# Altium project Kursovaya.PrjPcb
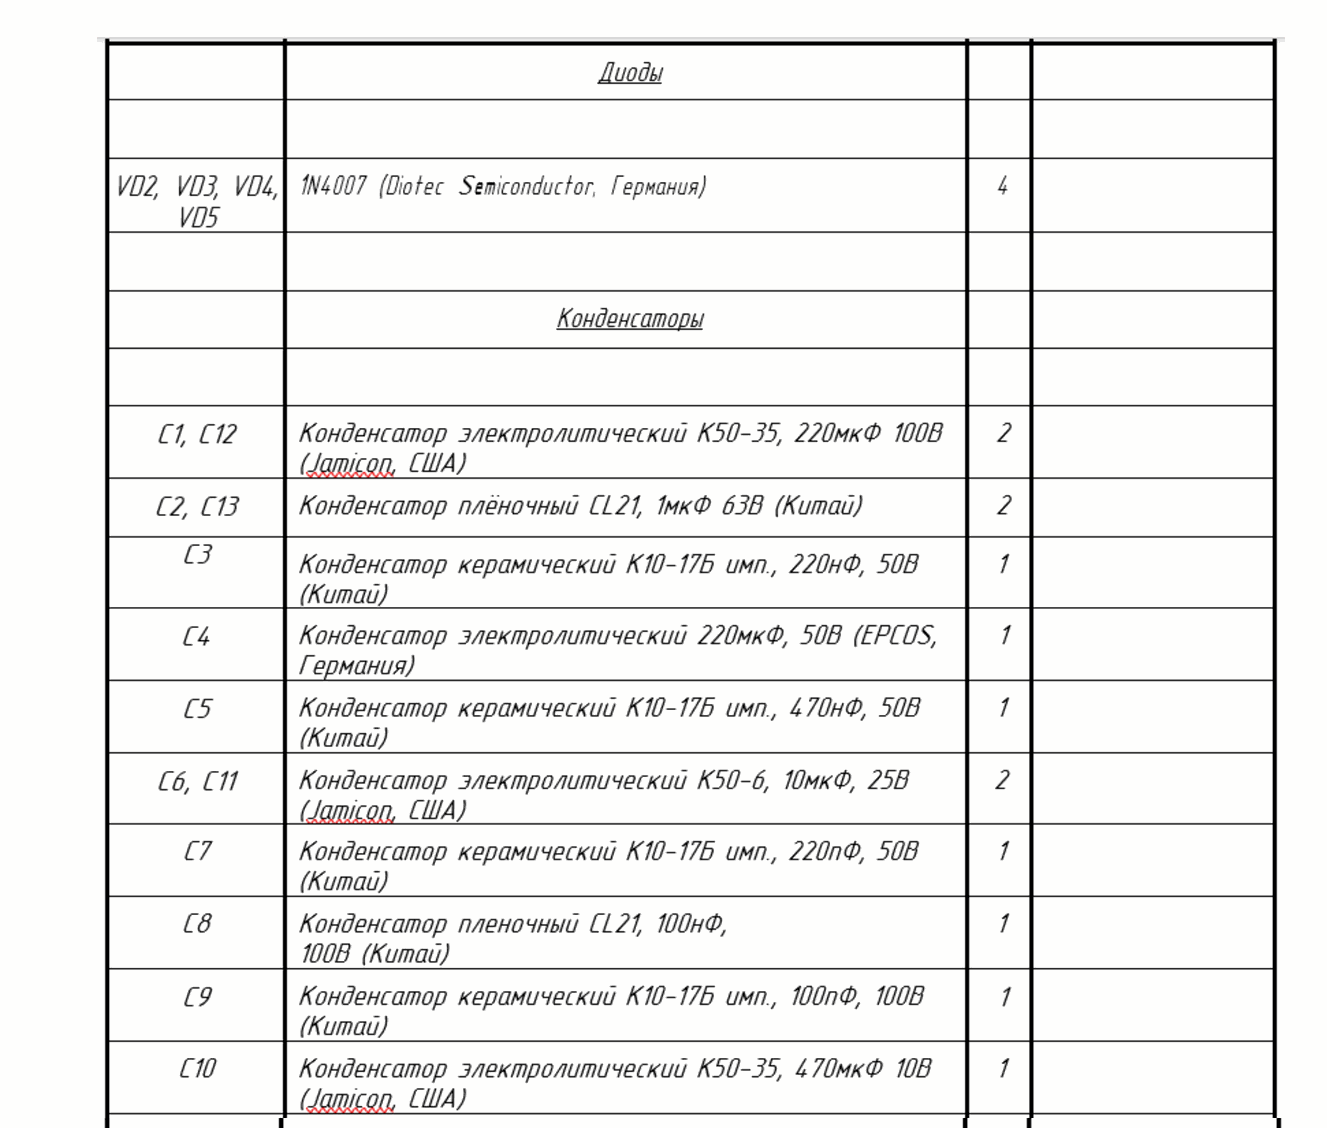
[diagram p0: Э3А1.SchDoc, top right]
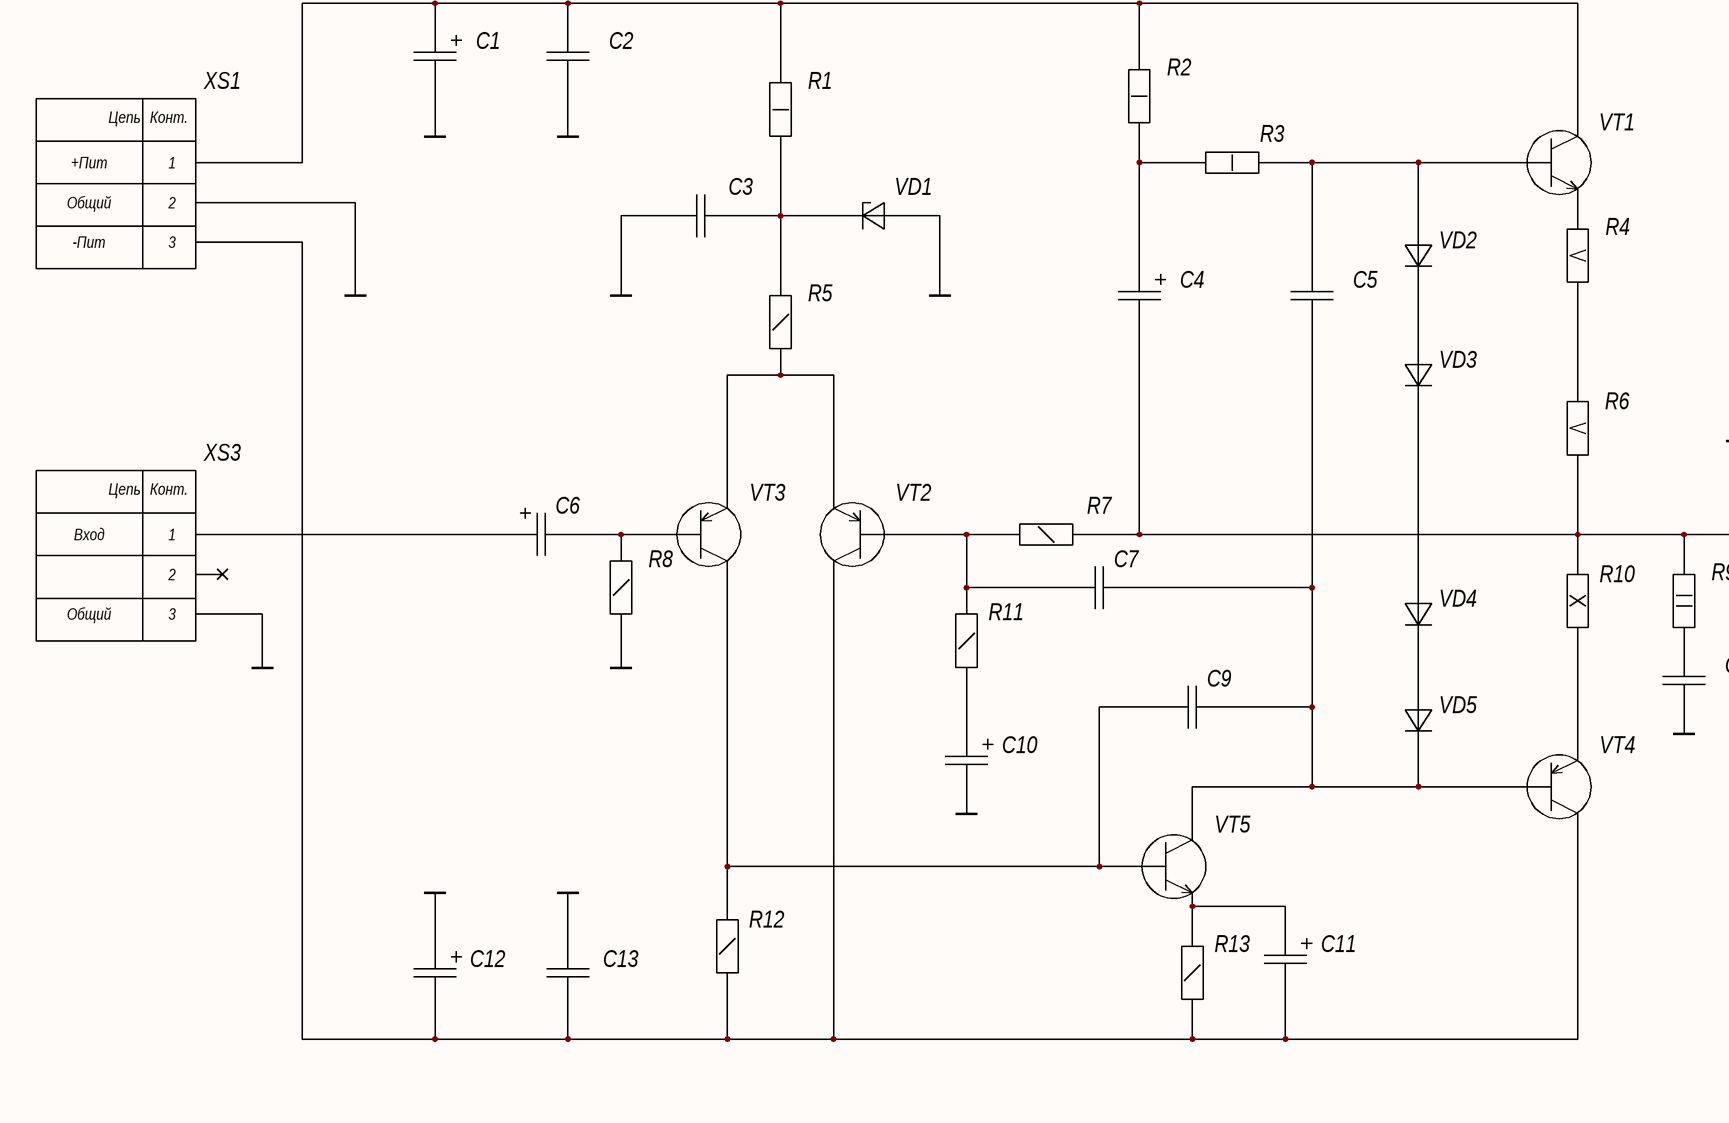
[diagram p1: Э3А1.SchDoc, bottom left]
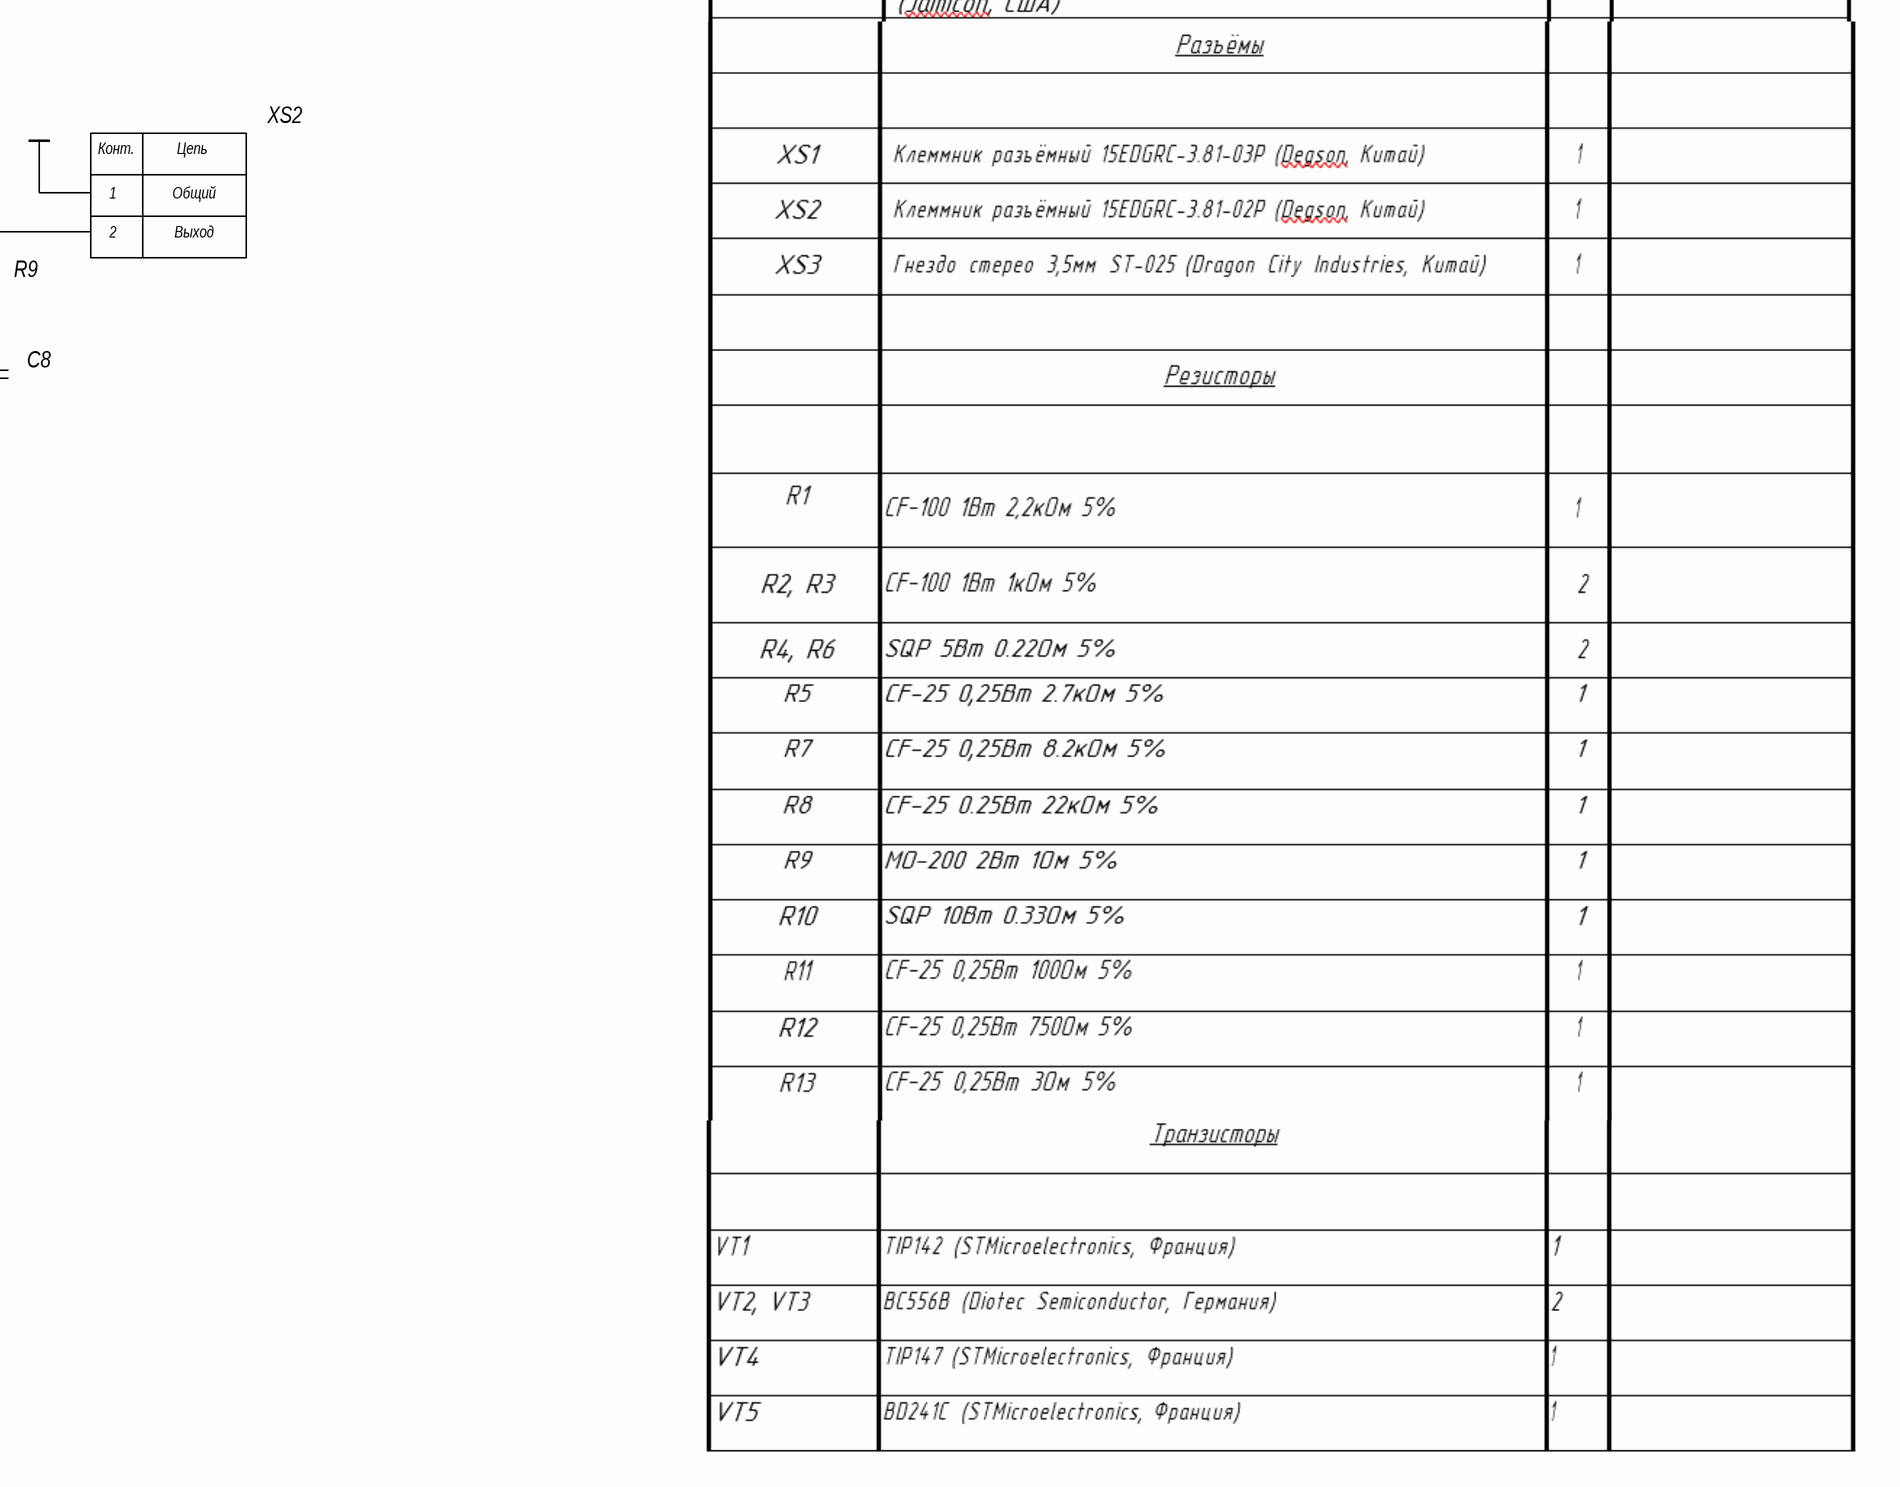
[diagram p2: Э3А1.SchDoc, bottom right]
4 sheets, 86 parts. Net scope: global (net labels, ports and power ports of the same name join across sheets).
Board files: PCBv1.PcbDoc, PCBv2.PcbDoc
Sheets:
  Э3А1.SchDoc
  Э1.SchDoc
  ПД1.SchDoc
  Э3А3.SchDoc

## Sheet Э3А1.SchDoc: Усилитель
size 840 x 594 mm; CheckedBy: Семенцов С.Г.; Author: Дорунц Ш.А.; Address1: Address1; Address2: Address2; Address3: Address3; Address4: Address4; DocumentNumber: ИУ4.11.03.03.23.05.52.09.001 Э3; SheetNumber: 1; SheetTotal: 3; Scale: 1:1; Title2str: Низких Частот; DocumentType: Схема электрическая принципиальная; FirstReferrence: ИУ4.11.03.03.23.05.52.09.001; UniversityName: МГТУ им. Н.Э. Баумана; DepartmentName: Кафедра ИУ4; GroupName: Группа ИУ4-52Б

### Parts
(Parts that share a designator on the sheet are numbered #1, #2 ... from top to bottom, then left to right.)
C1  220uF/100V  [Cap 220U/100V]  (value not drawn)
C2  1uF/63V  [Cap 1u/63V]  (value not drawn)
C3#1  220nF  [Cap 220nF]  (value not drawn)
C4#1  220uF/50V  [Cap 220U/100V]  (value not drawn)
C5  470nF  [Cap 470n]  (value not drawn)
C6#1  10uF/25V  [Cap 10u/25V]  (value not drawn)
C7#1  220pF  [Cap 220p]  (value not drawn)
C8  100nF/100V  [Cap 100n/100V]  (value not drawn)
C9  100pF/100V  [Cap 100p]  (value not drawn)
C10#1  470uF/10V  [Cap 470u/10V]  (value not drawn)
C11  10uF/25V  [Cap 10u/25V]  (value not drawn)
C12  220uF/100V  [Cap 220U/100V]  (value not drawn)
C13  1uF/63V  [Cap 1u/63V]  (value not drawn)
R1#1  Resistor 1W  [Res 1W]  (value not drawn)
R2#1  Resistor 1W  [Res 1W]  (value not drawn)
R3#1  Resistor 1W  [Res 1W]  (value not drawn)
R4#1  Resistor 5W  [Res 5W]  (value not drawn)
R5#1  Resistor 0.25W  [Res 0.25W]  (value not drawn)
R6#1  Resistor 5W  [Res 5W]  (value not drawn)
R7#1  Resistor 0.25W  [Res 0.25W]  (value not drawn)
R8#1  Resistor 0.25W  [Res 0.25W]  (value not drawn)
R9#1  Resistor 2W  [Res 2W]  (value not drawn)
R10#1  Resistor 10W  [Res 10W]  (value not drawn)
R11#1  Resistor 0.25W  [Res 0.25W]  (value not drawn)
R12#1  Resistor 0.25W  [Res 0.25W]  (value not drawn)
R13#1  Resistor 0.25W  [Res 0.25W]  (value not drawn)
VD1#1  ZPD12  [DO-35]  (value not drawn)
VD2  Diode 1N4001  [DO-41]  (value not drawn)
VD3  Diode 1N4001  [DO-41]  (value not drawn)
VD4  Diode 1N4001  [DO-41]  (value not drawn)
VD5  Diode 1N4001  [DO-41]  (value not drawn)
VT1  TIP142  [TO-247]  (value not drawn)
VT2#1  BC556B  [TO-92-A]  (value not drawn)
VT3#1  BC556B  [TO-92-A]  (value not drawn)
VT4  TIP147  [TO-247]  (value not drawn)
VT5  BD241C  [TO-220]  (value not drawn)
XS1#1  Connector 15EDGRC-3.81-03P  [15EDGRC-3.81-03P]  (value not drawn)
XS2#1  Connector 15EDGRC-3.81-02P  [15EDGRC-3.81-02P]  (value not drawn)
XS3#1  Connector ST-025  [ST-025]  (value not drawn)

### Nets
GND: C1.2 C2.1 C3#1.2 C8.1 C10#1.2 C12.1 C13.1 R8#1.1 VD1#1.1(А) XS1#1.2 XS2#1.1 XS3#1.3
NetC1_1: C1.1 C2.2 R1#1.2 R2#1.2 VT1.2(C) XS1#1.1
NetC3#1_1: C3#1.1 R1#1.1 R5#1.2 VD1#1.2(К)
NetC4#1_1: C4#1.1 R2#1.1 R3#1.1
NetC4#1_2: C4#1.2 R6#1.2 R7#1.2 R9#1.2 R10#1.2 XS2#1.2
NetC5_1: C5.1 C7#1.2 C9.2 VD5.2(К) VT4.1(B) VT5.2(C)
NetC5_2: C5.2 R3#1.2 VD2.1(А) VT1.1(B)
NetC6#1_1: C6#1.1 XS3#1.1
NetC6#1_2: C6#1.2 R8#1.2 VT3#1.2(B)
NetC7#1_1: C7#1.1 R7#1.1 R11#1.2 VT2#1.2(B)
NetC8_2: C8.2 R9#1.1
NetC9_1: C9.1 R12#1.2 VT3#1.1(C) VT5.1(B)
NetC10#1_1: C10#1.1 R11#1.1
NetC11_1: C11.1 R13#1.2 VT5.3(E)
NetC11_2: C11.2 C12.2 C13.2 R12#1.1 R13#1.1 VT2#1.1(C) VT4.2(C) XS1#1.3
NetR4#1_1: R4#1.1 VT1.3(E)
NetR4#1_2: R4#1.2 R6#1.1
NetR5#1_1: R5#1.1 VT2#1.3(E) VT3#1.3(E)
NetR10#1_1: R10#1.1 VT4.3(E)
NetVD2_2: VD2.2(К) VD3.1(А)
NetVD3_2: VD3.2(К) VD4.1(А)
NetVD4_2: VD4.2(К) VD5.1(А)

Not connected (* = marked no-connect by the designer): XS3#1 2*

### Notes on the sheet
- +Пит
- Общий
- -Пит
- Вход
- Выход
- Перв. примен.
- Справ. №
- Подп. и дата
- Инв. № дубл.
- Взам. инв. №
- Разраб.
- Изм.
- Лист
- № докум.
- Подп.
- Дата
- Лит.
- Масса
- Масштаб
- Пров.
- Т.контр.
- Листов
- 1
- Инв. № подл.
- Утв.
- Н.контр.
- 2.106-A1
- Копировал
- Формат А1
- (in symbol Connector 15EDGRC-3.81-02P) Конт.; Цепь
- (in symbol Connector 15EDGRC-3.81-03P) Цепь; Конт.
- (in symbol Connector ST-025) Цепь; Конт.

### Library data of the parts
C1 C12 = Capacitor 220uF 100V: Type: Конденсатор; Published: 18.05.2010; Publisher: Andrew Danich
C2 C13 = Capacitor 1uF 63V: Type: Конденсатор; Published: 18.05.2010; Publisher: Andrew Danich
C3#1 = Capacitor 220nF: Type: Конденсатор; Published: 18.05.2010; Publisher: Andrew Danich
C4#1 = Capacitor 220uF 50V: Type: Конденсатор; Published: 18.05.2010; Publisher: Andrew Danich
C5 = Capacitor 470nF: Type: Конденсатор; Published: 18.05.2010; Publisher: Andrew Danich
C6#1 C11 = Capacitor 10uF 25V: Type: Конденсатор; Published: 18.05.2010; Publisher: Andrew Danich
C7#1 = Capacitor 220pF: Type: Конденсатор; Published: 18.05.2010; Publisher: Andrew Danich
C8 = Capacitor 100nF 100V: Type: Конденсатор; Published: 18.05.2010; Publisher: Andrew Danich
C9 = Capacitor 100pF 100V: Type: Конденсатор; Published: 18.05.2010; Publisher: Andrew Danich
C10#1 = Capacitor 470uF 10V: Type: Конденсатор; Published: 18.05.2010; Publisher: Andrew Danich
VD1#1 = ZPD12: Type: Стабилитрон; Published: 20.05.2013; Publisher: Andrew Danich
VD2-VD5 = Diode 1N4001: Type: Диод; Published: 18.05.2010; Publisher: Andrew Danich
R1#1 R2#1 R3#1 = Resistor 1W: Published: 24.03.2010; Publisher: Andrew Danich; Type: Резистор
R4#1 R6#1 = Resistor 5W: Published: 24.03.2010; Publisher: Andrew Danich; Type: Резистор
R5#1 R7#1 R8#1 R11#1 R12#1 R13#1 = Resistor 0.25W: Published: 24.03.2010; Publisher: Andrew Danich; Type: Резистор
R9#1 = Resistor 2W: Published: 24.03.2010; Publisher: Andrew Danich; Type: Резистор
R10#1 = Resistor 10W: Published: 24.03.2010; Publisher: Andrew Danich; Type: Резистор

## Sheet Э1.SchDoc: Усилитель
size 420 x 297 mm; =Author: Дорунц Ш.А.; CheckedBy: Семенцов С.Г.; Author: Дорунц Ш.А.; Address1: Address1; Address2: Address2; Address3: Address3; Address4: Address4; DocumentNumber: ИУ4.11.03.03.23.05.09.001 Э1; SheetNumber: 2; SheetTotal: 4; Scale: 1:1; Title2str: низких частот; DocumentType: Схема электрическая структурная; FirstReferrence: ИУ4.11.03.03.23.05.52.09.001; UniversityName: МГТУ им. Н.Э. Баумана; DepartmentName: Кафедра ИУ4; GroupName: Группа ИУ4-52Б
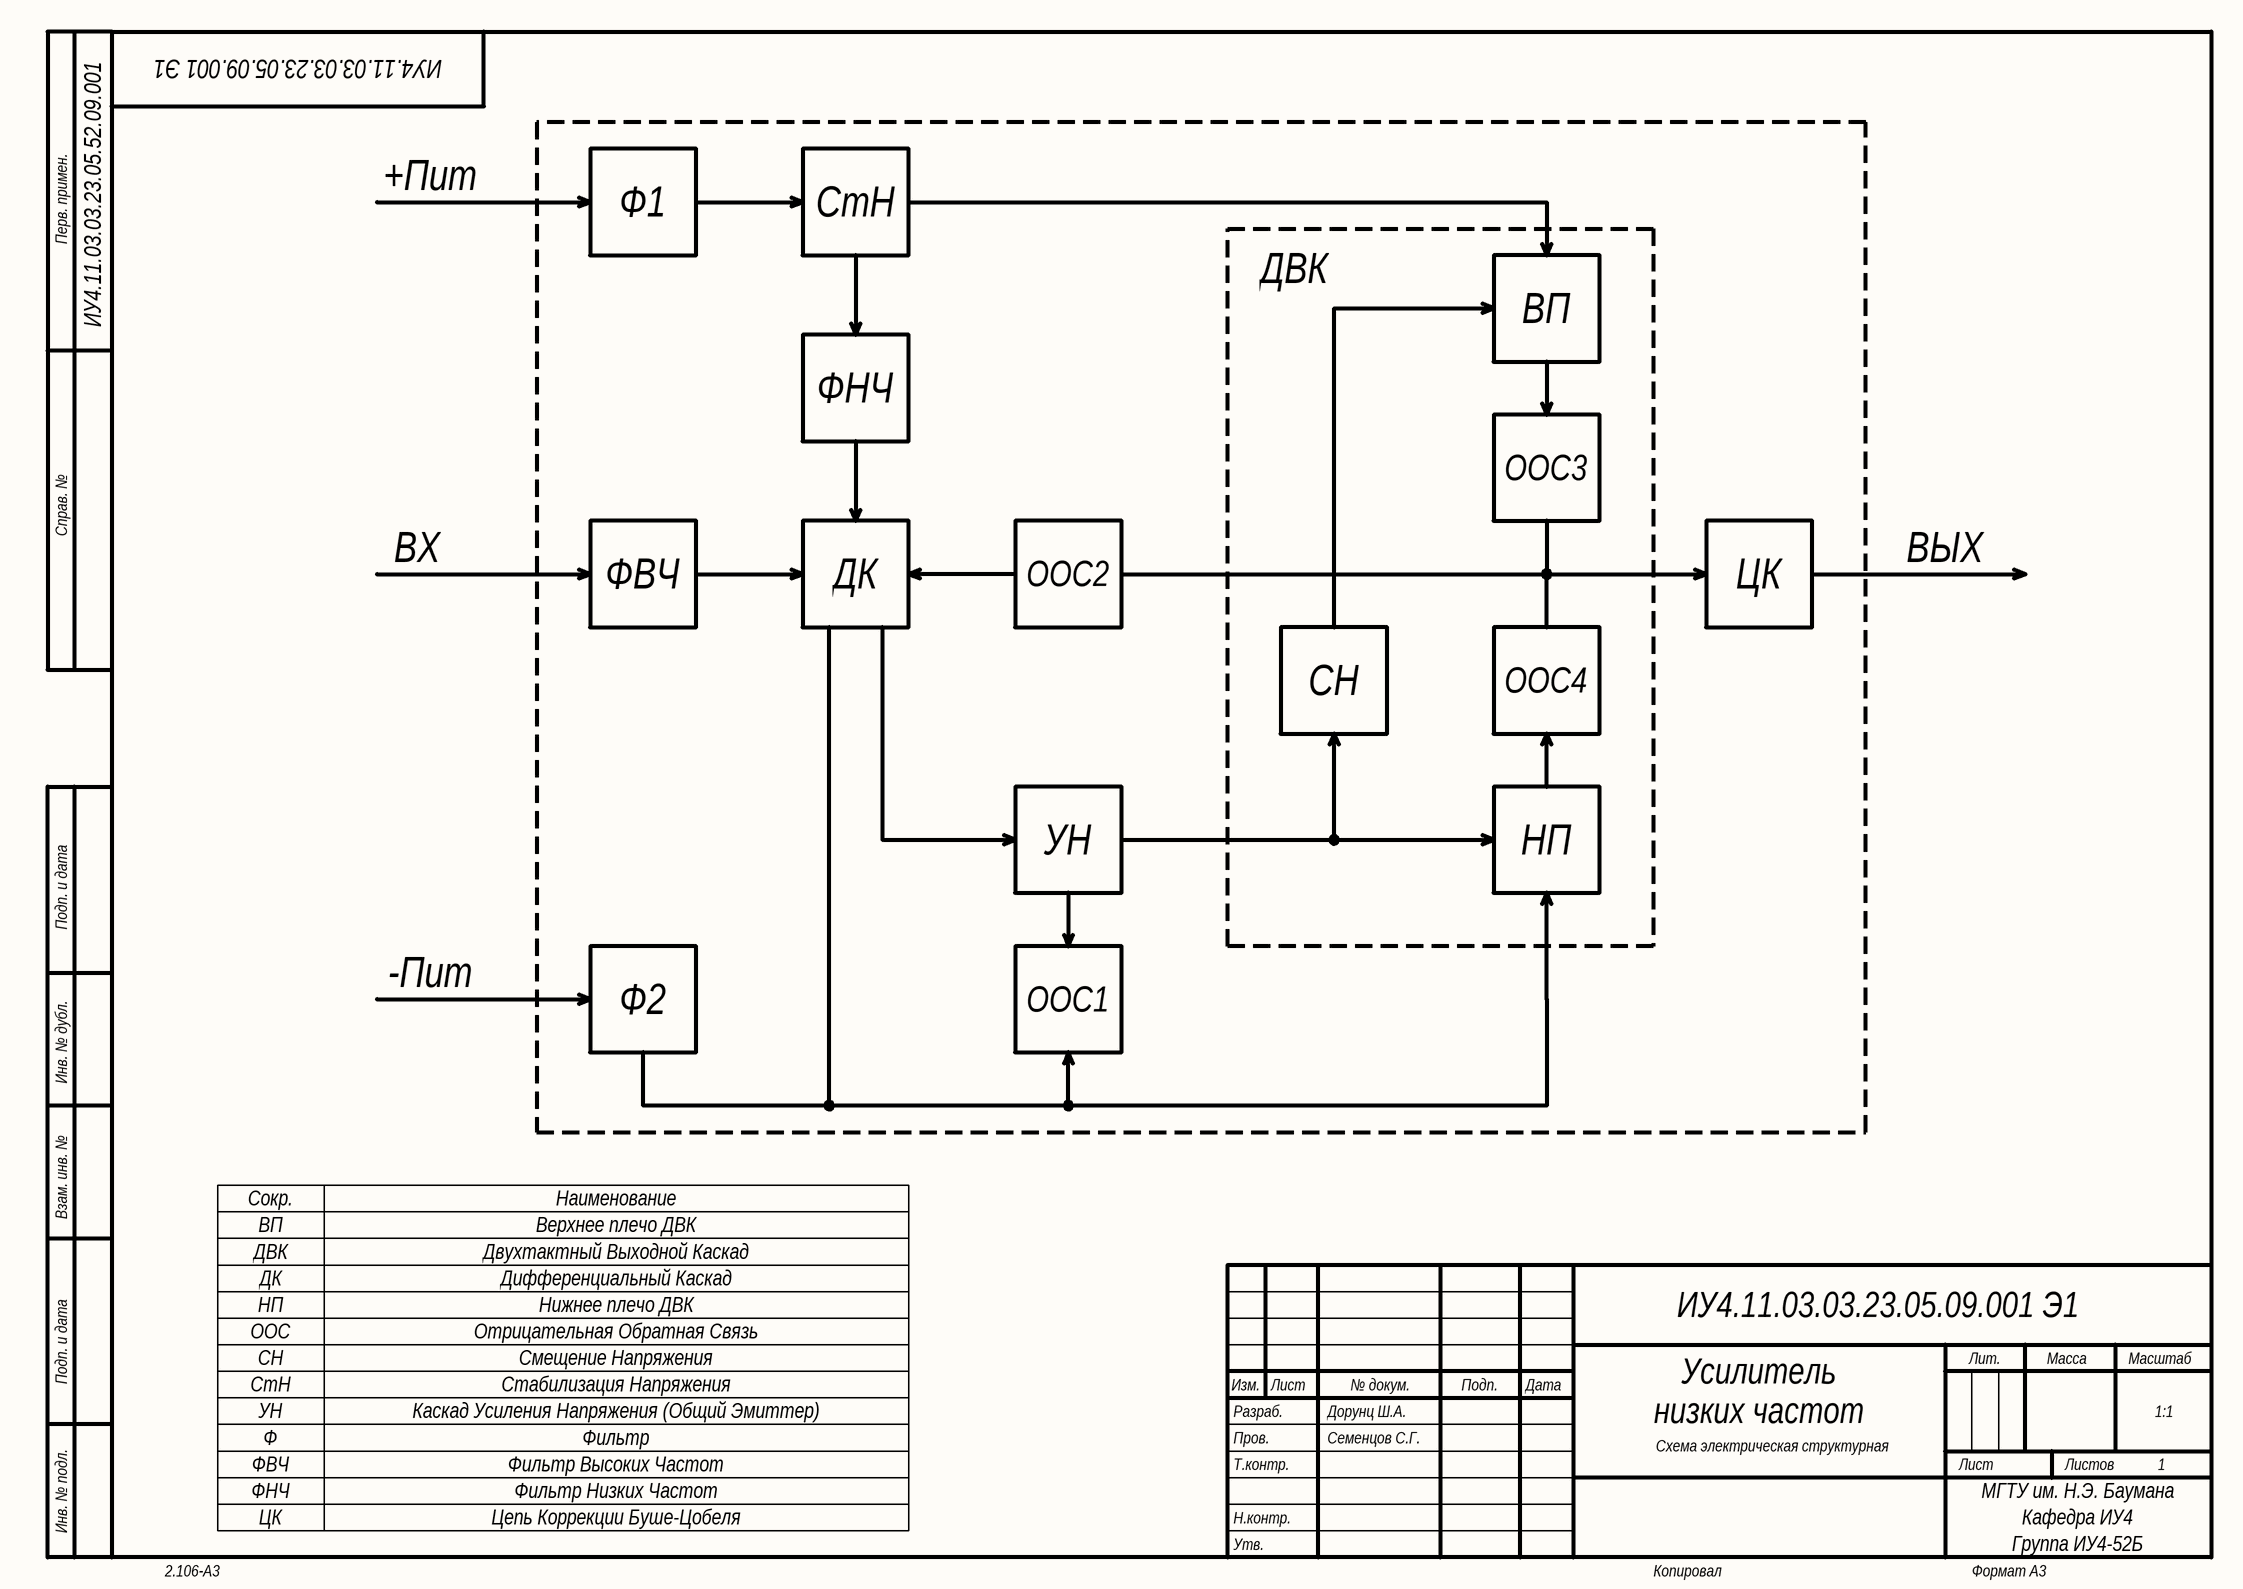
[diagram p3: Э1.SchDoc]

### Notes on the sheet
- +Пит
- Ф1
- СтН
- ДВК
- ВП
- ФНЧ
- ООС3
- ВХ
- ФВЧ
- ДК
- ООС2
- ЦК
- ВЫХ
- СН
- ООС4
- УН
- НП
- -Пит
- Ф2
- ООС1
- Сокр.
- Наименование
- Верхнее плечо ДВК
- Двухтактный Выходной Каскад
- Дифференциальный Каскад
- ООС
- Нижнее плечо ДВК
- Отрицательная Обратная Связь
- Каскад Усиления Напряжения (Общий Эмиттер)
- Смещение Напряжения
- Стабилизация Напряжения
- Ф
- Фильтр
- Фильтр Высоких Частот
- Цепь Коррекции Буше-Цобеля
- Фильтр Низких Частот
- Перв. примен.
- Справ. №
- Подп. и дата
- Инв. № дубл.
- Взам. инв. №
- Разраб.
- Изм.
- Лист
- № докум.
- Подп.
- Дата
- Лит.
- Масса
- Масштаб
- Пров.
- Т.контр.
- Листов
- 1
- Инв. № подл.
- Утв.
- Н.контр.
- 2.106-A3
- Копировал
- Формат А3

## Sheet ПД1.SchDoc: Усилитель
size 420 x 297 mm; CheckedBy: Семенцов С.Г.; Author: Дорунц Ш.А.; Address1: Address1; Address2: Address2; Address3: Address3; Address4: Address4; DocumentNumber: ИУ4.11.03.03.23.05.09.001; SheetNumber: 3; SheetTotal: 4; Scale: 1:1; Title2str: Низких Частот; DocumentType: Схема измерительного стенда; FirstReferrence: ИУ4.11.03.03.23.05.52.09.001; UniversityName: МГТУ им. Н.Э. Баумана; DepartmentName: Кафедра ИУ4; GroupName: Группа ИУ4-52Б
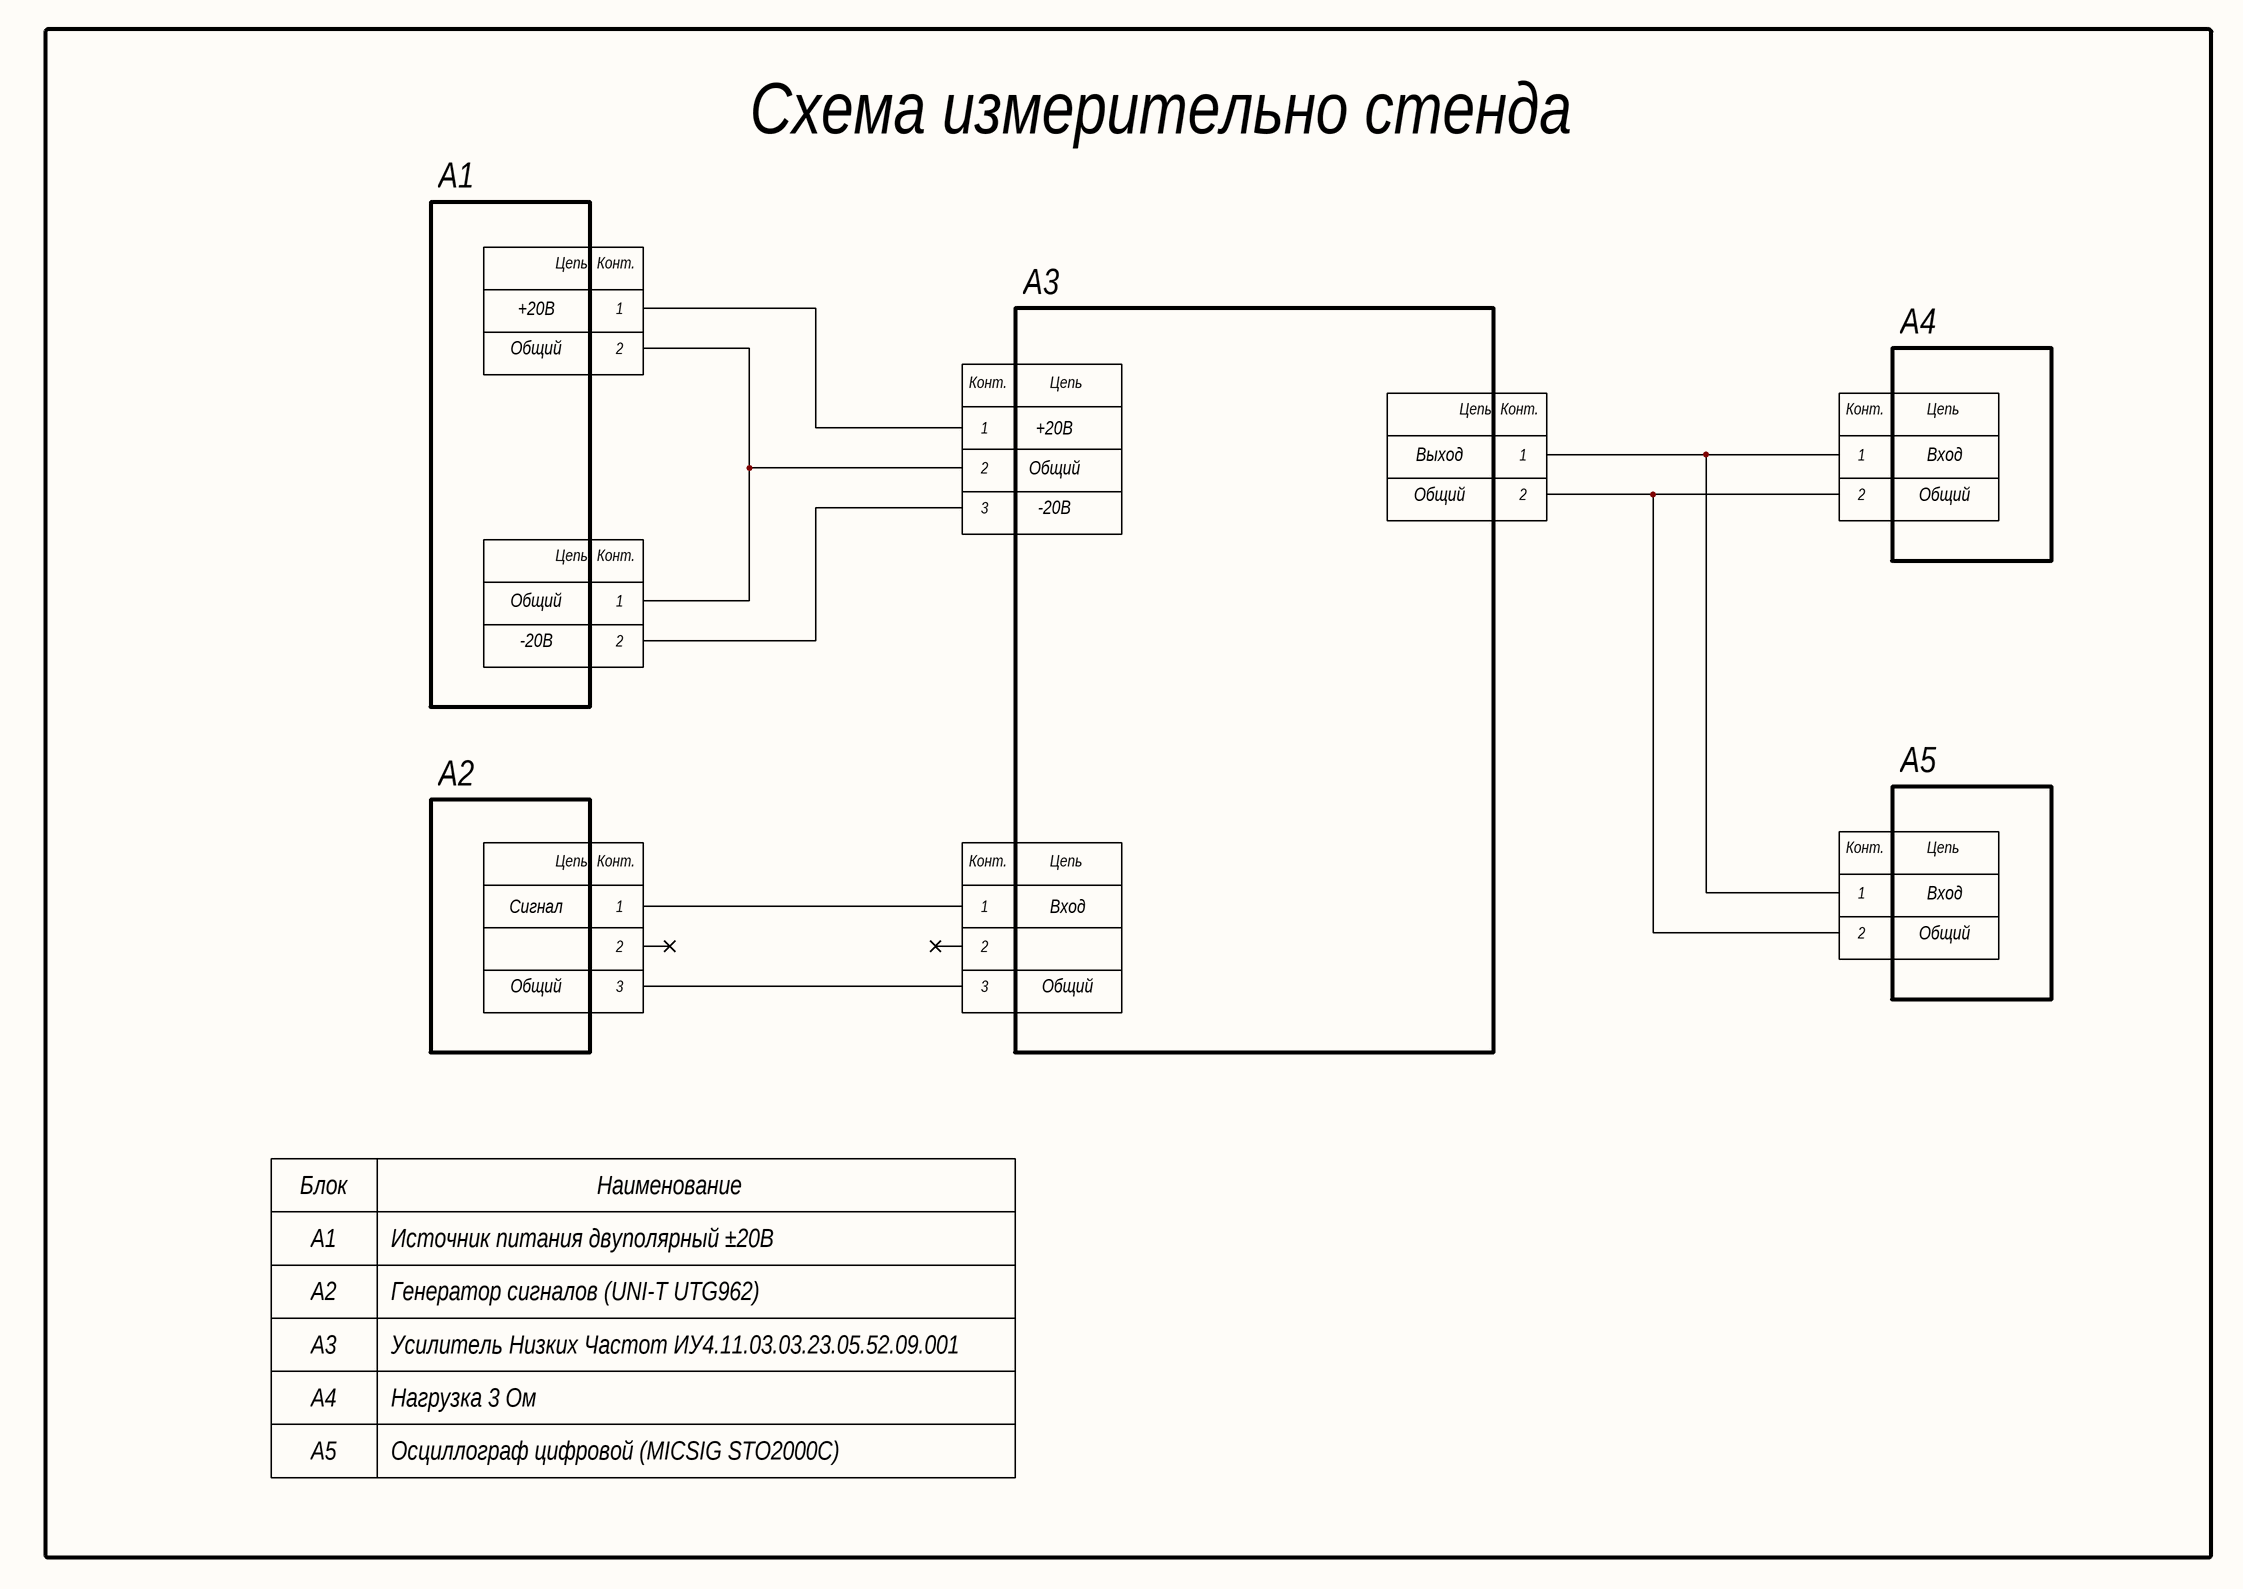
[diagram p4: ПД1.SchDoc]

### Parts
XS4  Connector 15EDGRC-3.81-02P  [15EDGRC-3.81-02P]  (value not drawn)
XS5  Connector 15EDGRC-3.81-03P  [15EDGRC-3.81-03P]  (value not drawn)
XS6  Connector 15EDGRC-3.81-02P  [15EDGRC-3.81-02P]  (value not drawn)
XS7  Connector 15EDGRC-3.81-02P  [15EDGRC-3.81-02P]  (value not drawn)
XS8  Connector 15EDGRC-3.81-02P  [15EDGRC-3.81-02P]  (value not drawn)
XS10  Connector 15EDGRC-3.81-02P  [15EDGRC-3.81-02P]  (value not drawn)
XS11  Connector ST-025  [ST-025]  (value not drawn)
XS?  Connector ST-025  [ST-025]  (value not drawn)

### Nets
NetXS4_1: XS4.1 XS5.1
NetXS4_2: XS4.2 XS5.2 XS8.1
NetXS5_3: XS5.3 XS8.2
NetXS6_1: XS6.1 XS7.1 XS10.1
NetXS6_2: XS6.2 XS7.2 XS10.2
NetXS11_1: XS11.1 XS?.1
NetXS11_3: XS11.3 XS?.3

Not connected (* = marked no-connect by the designer): XS11 2*; XS? 2*

### Notes on the sheet
- Схема измерительно стенда
- A1
- +20В
- А3
- А4
- Общий
- Выход
- Вход
- -20В
- A2
- А5
- Сигнал
- Блок
- Наименование
- А1
- Источник питания двуполярный ±20В
- А2
- Генератор сигналов (UNI-T UTG962)
- Усилитель Низких Частот ИУ4.11.03.03.23.05.52.09.001
- Нагрузка 3 Ом
- Осциллограф цифровой (MICSIG STO2000C)
- Перв. примен.
- Справ. №
- Подп. и дата
- Инв. № дубл.
- Взам. инв. №
- Разраб.
- Изм.
- Лист
- № докум.
- Подп.
- Дата
- Лит.
- Масса
- Масштаб
- Пров.
- Т.контр.
- Листов
- 1
- Инв. № подл.
- Утв.
- Н.контр.
- 2.106-A3
- Копировал
- Формат А3
- (in symbol Connector 15EDGRC-3.81-02P) Цепь; Конт.
- (in symbol Connector 15EDGRC-3.81-03P) Конт.; Цепь
- (in symbol Connector ST-025) Конт.; Цепь

## Sheet Э3А3.SchDoc
size 420 x 297 mm; SheetNumber: 4; SheetTotal: 4; Scale: 1:1
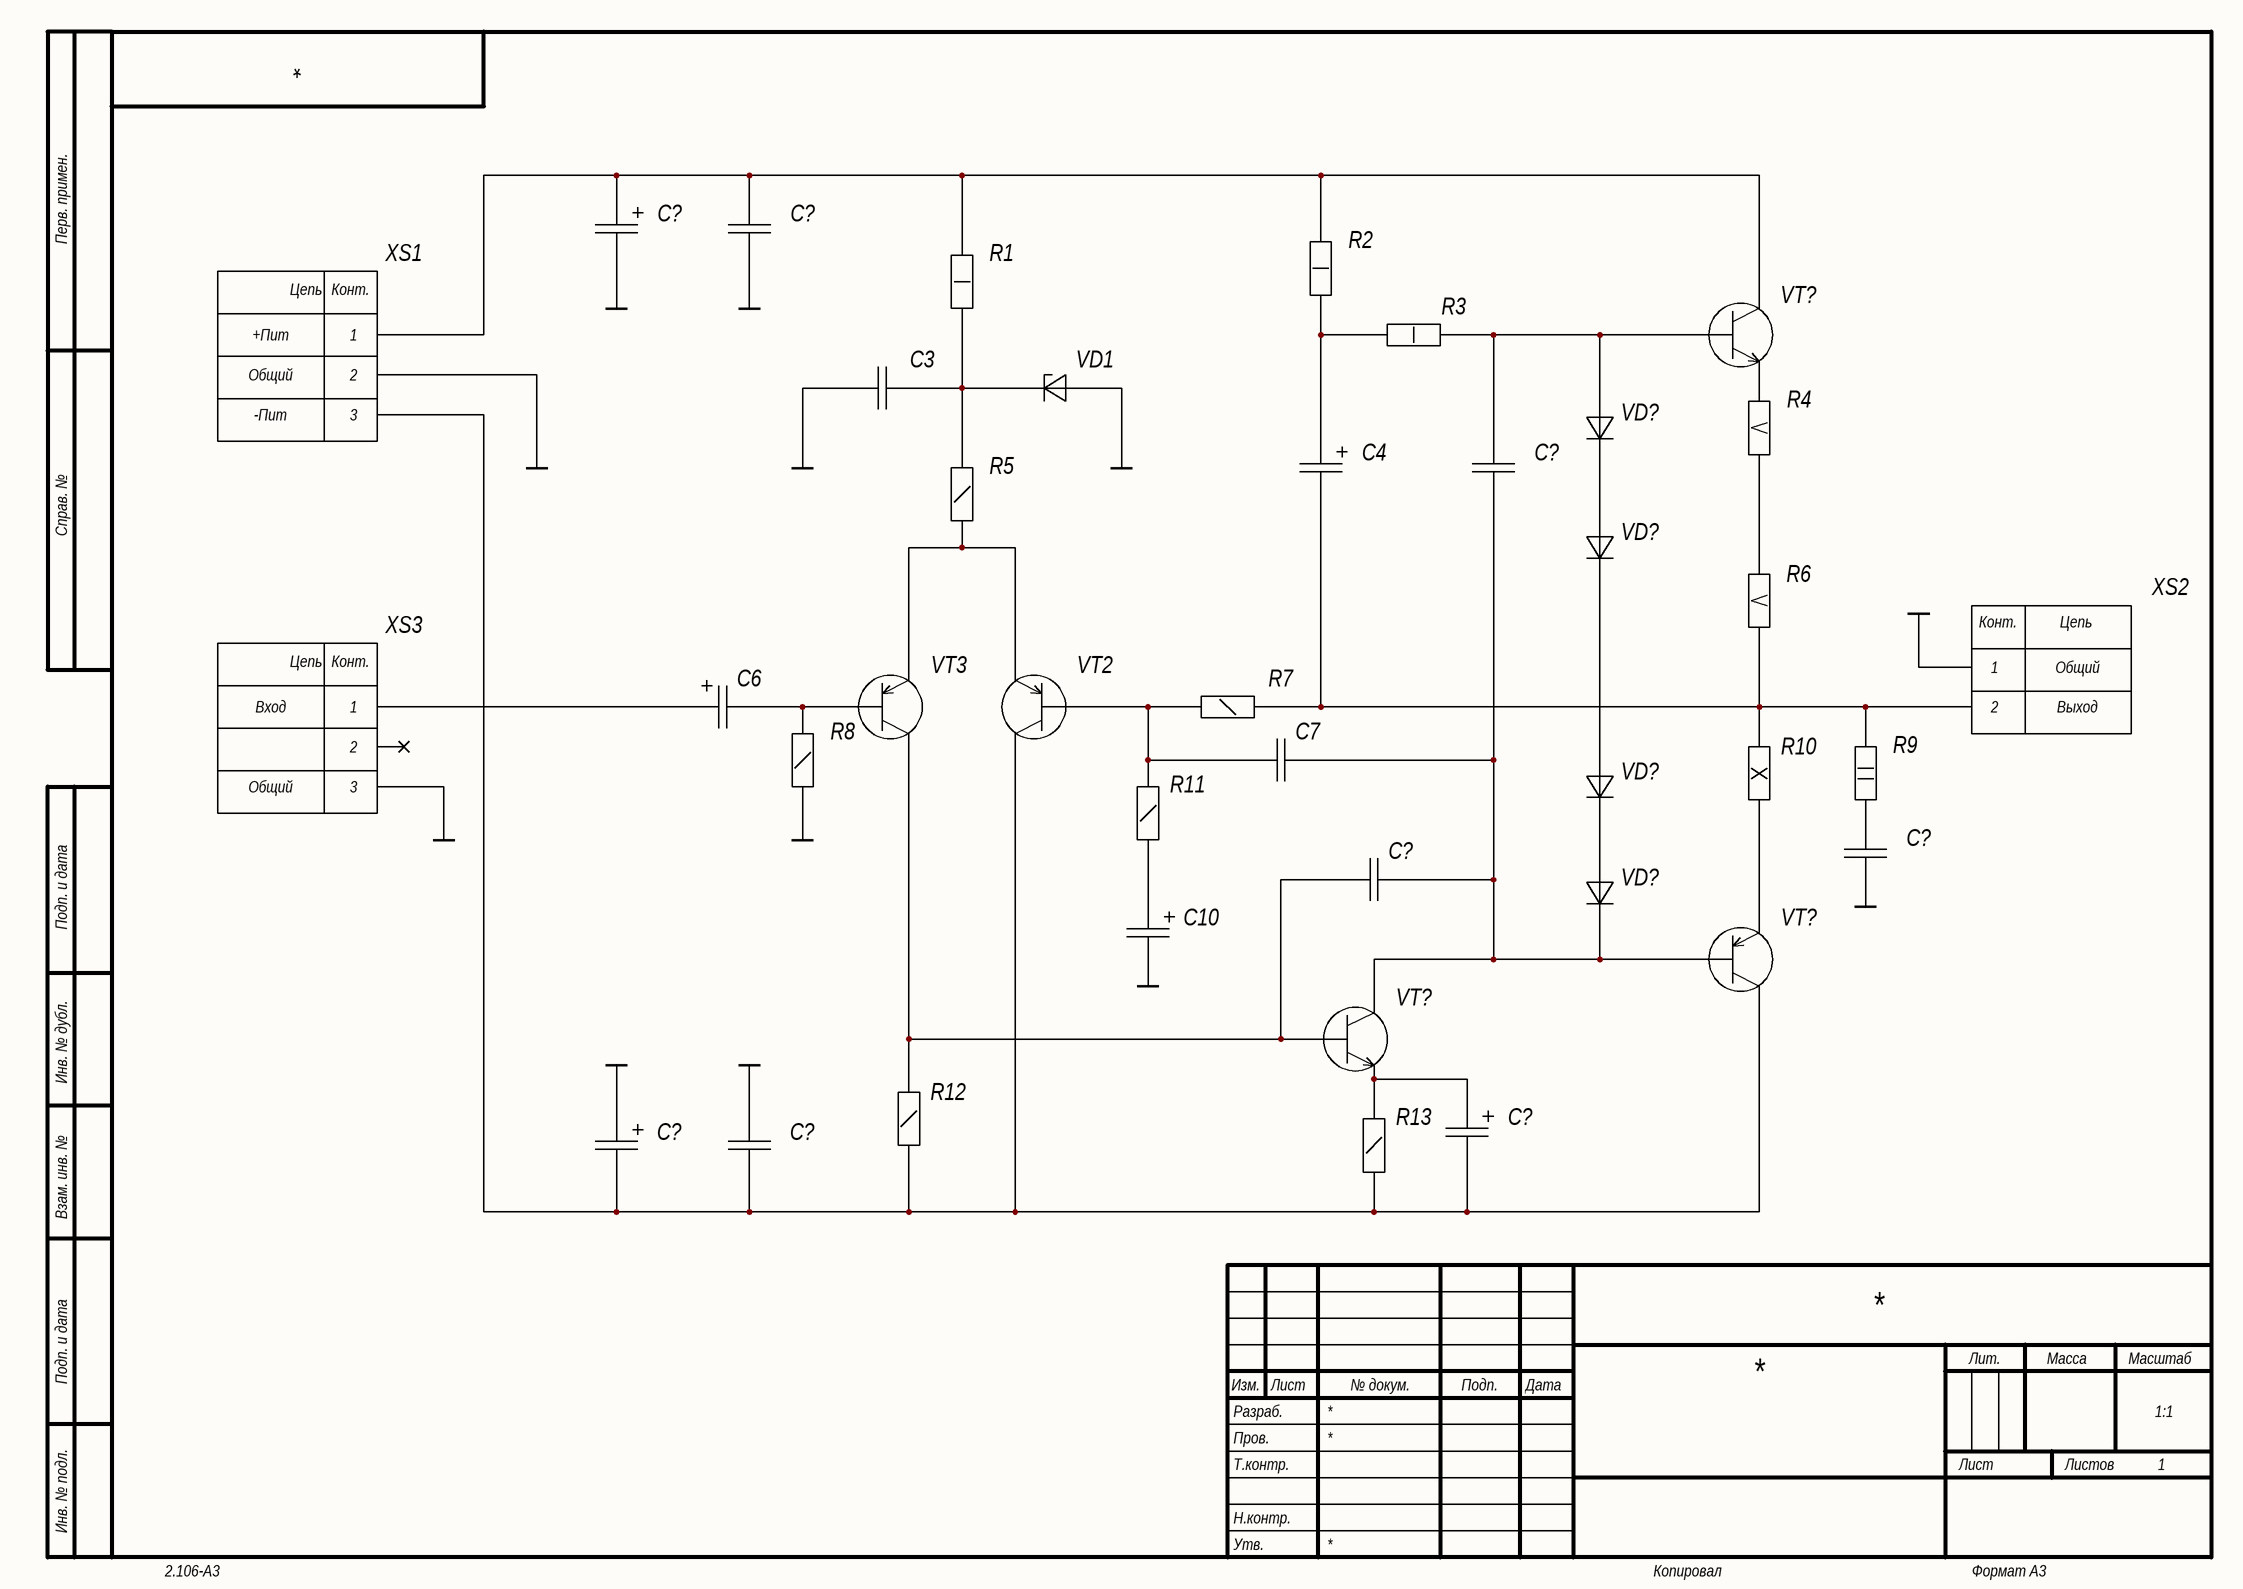
[diagram p5: Э3А3.SchDoc]

### Parts
(Parts that share a designator on the sheet are numbered #1, #2 ... from top to bottom, then left to right.)
C3#2  220nF  [Cap 220nF]  (value not drawn)
C4#2  220uF/50V  [Cap 220U/100V]  (value not drawn)
C6#2  10uF/25V  [Cap 10u/25V]  (value not drawn)
C7#2  220pF  [Cap 220p]  (value not drawn)
C10#2  470uF/10V  [Cap 470u/10V]  (value not drawn)
C?#1  220uF/100V  [Cap 220U/100V]  (value not drawn)
C?#2  1uF/63V  [Cap 1u/63V]  (value not drawn)
C?#3  470nF  [Cap 470n]  (value not drawn)
C?#4  100nF/100V  [Cap 100n/100V]  (value not drawn)
C?#5  100pF/100V  [Cap 100p]  (value not drawn)
C?#6  10uF/25V  [Cap 10u/25V]  (value not drawn)
C?#7  220uF/100V  [Cap 220U/100V]  (value not drawn)
C?#8  1uF/63V  [Cap 1u/63V]  (value not drawn)
R1#2  Resistor 1W  [Res 1W]  (value not drawn)
R2#2  Resistor 1W  [Res 1W]  (value not drawn)
R3#2  Resistor 1W  [Res 1W]  (value not drawn)
R4#2  Resistor 5W  [Res 5W]  (value not drawn)
R5#2  Resistor 0.25W  [Res 0.25W]  (value not drawn)
R6#2  Resistor 5W  [Res 5W]  (value not drawn)
R7#2  Resistor 0.25W  [Res 0.25W]  (value not drawn)
R8#2  Resistor 0.25W  [Res 0.25W]  (value not drawn)
R9#2  Resistor 2W  [Res 2W]  (value not drawn)
R10#2  Resistor 10W  [Res 10W]  (value not drawn)
R11#2  Resistor 0.25W  [Res 0.25W]  (value not drawn)
R12#2  Resistor 0.25W  [Res 0.25W]  (value not drawn)
R13#2  Resistor 0.25W  [Res 0.25W]  (value not drawn)
VD1#2  ZPD12  [DO-35]  (value not drawn)
VD?#1  Diode 1N4001  [DO-41]  (value not drawn)
VD?#2  Diode 1N4001  [DO-41]  (value not drawn)
VD?#3  Diode 1N4001  [DO-41]  (value not drawn)
VD?#4  Diode 1N4001  [DO-41]  (value not drawn)
VT2#2  BC556B  [TO-92-A]  (value not drawn)
VT3#2  BC556B  [TO-92-A]  (value not drawn)
VT?#1  TIP142  [TO-247]  (value not drawn)
VT?#2  TIP147  [TO-247]  (value not drawn)
VT?#3  BD241C  [TO-220]  (value not drawn)
XS1#2  Connector 15EDGRC-3.81-03P  [15EDGRC-3.81-03P]  (value not drawn)
XS2#2  Connector 15EDGRC-3.81-02P  [15EDGRC-3.81-02P]  (value not drawn)
XS3#2  Connector ST-025  [ST-025]  (value not drawn)

### Nets
GND: C3#2.2 C10#2.2 C?#1.2 C?#2.1 C?#4.1 C?#7.1 C?#8.1 R8#2.1 VD1#2.1(А) XS1#2.2 XS2#2.1 XS3#2.3
NetC3#2_1: C3#2.1 R1#2.1 R5#2.2 VD1#2.2(К)
NetC4#2_1: C4#2.1 R2#2.1 R3#2.1
NetC4#2_2: C4#2.2 R6#2.2 R7#2.2 R9#2.2 R10#2.2 XS2#2.2
NetC6#2_1: C6#2.1 XS3#2.1
NetC6#2_2: C6#2.2 R8#2.2 VT3#2.2(B)
NetC7#2_1: C7#2.1 R7#2.1 R11#2.2 VT2#2.2(B)
NetC7#2_2: C7#2.2 C?#3.1 C?#5.2 VD?#4.2(К) VT?#2.1(B) VT?#3.2(C)
NetC10#2_1: C10#2.1 R11#2.1
NetC?#1_1: C?#1.1 C?#2.2 R1#2.2 R2#2.2 VT?#1.2(C) XS1#2.1
NetC?#3_2: C?#3.2 R3#2.2 VD?#1.1(А) VT?#1.1(B)
NetC?#4_2: C?#4.2 R9#2.1
NetC?#5_1: C?#5.1 R12#2.2 VT3#2.1(C) VT?#3.1(B)
NetC?#6_1: C?#6.1 R13#2.2 VT?#3.3(E)
NetC?#6_2: C?#6.2 C?#7.2 C?#8.2 R12#2.1 R13#2.1 VT2#2.1(C) VT?#2.2(C) XS1#2.3
NetR4#2_1: R4#2.1 VT?#1.3(E)
NetR4#2_2: R4#2.2 R6#2.1
NetR5#2_1: R5#2.1 VT2#2.3(E) VT3#2.3(E)
NetR10#2_1: R10#2.1 VT?#2.3(E)
NetVD?#1_2: VD?#1.2(К) VD?#2.1(А)
NetVD?#2_2: VD?#2.2(К) VD?#3.1(А)
NetVD?#3_2: VD?#3.2(К) VD?#4.1(А)

Not connected (* = marked no-connect by the designer): XS3#2 2*

### Notes on the sheet
- +Пит
- Общий
- -Пит
- Вход
- Выход
- Перв. примен.
- Справ. №
- Подп. и дата
- Инв. № дубл.
- Взам. инв. №
- Разраб.
- Изм.
- Лист
- № докум.
- Подп.
- Дата
- Лит.
- Масса
- Масштаб
- Пров.
- Т.контр.
- Листов
- 1
- Инв. № подл.
- Утв.
- Н.контр.
- 2.106-A3
- Копировал
- Формат А3
- (in symbol Connector 15EDGRC-3.81-02P) Конт.; Цепь
- (in symbol Connector 15EDGRC-3.81-03P) Цепь; Конт.
- (in symbol Connector ST-025) Цепь; Конт.

### Library data of the parts
C3#2 = Capacitor 220nF: Type: Конденсатор; Published: 18.05.2010; Publisher: Andrew Danich
C4#2 = Capacitor 220uF 50V: Type: Конденсатор; Published: 18.05.2010; Publisher: Andrew Danich
C6#2 C?#6 = Capacitor 10uF 25V: Type: Конденсатор; Published: 18.05.2010; Publisher: Andrew Danich
C7#2 = Capacitor 220pF: Type: Конденсатор; Published: 18.05.2010; Publisher: Andrew Danich
C10#2 = Capacitor 470uF 10V: Type: Конденсатор; Published: 18.05.2010; Publisher: Andrew Danich
C?#1 C?#7 = Capacitor 220uF 100V: Type: Конденсатор; Published: 18.05.2010; Publisher: Andrew Danich
C?#2 C?#8 = Capacitor 1uF 63V: Type: Конденсатор; Published: 18.05.2010; Publisher: Andrew Danich
C?#3 = Capacitor 470nF: Type: Конденсатор; Published: 18.05.2010; Publisher: Andrew Danich
C?#4 = Capacitor 100nF 100V: Type: Конденсатор; Published: 18.05.2010; Publisher: Andrew Danich
C?#5 = Capacitor 100pF 100V: Type: Конденсатор; Published: 18.05.2010; Publisher: Andrew Danich
VD1#2 = ZPD12: Type: Стабилитрон; Published: 20.05.2013; Publisher: Andrew Danich
VD?#1-VD?#4 = Diode 1N4001: Type: Диод; Published: 18.05.2010; Publisher: Andrew Danich
R1#2 R2#2 R3#2 = Resistor 1W: Published: 24.03.2010; Publisher: Andrew Danich; Type: Резистор
R4#2 R6#2 = Resistor 5W: Published: 24.03.2010; Publisher: Andrew Danich; Type: Резистор
R5#2 R7#2 R8#2 R11#2 R12#2 R13#2 = Resistor 0.25W: Published: 24.03.2010; Publisher: Andrew Danich; Type: Резистор
R9#2 = Resistor 2W: Published: 24.03.2010; Publisher: Andrew Danich; Type: Резистор
R10#2 = Resistor 10W: Published: 24.03.2010; Publisher: Andrew Danich; Type: Резистор

## Nets that join several sheets
GND: Э3А1 (12 pins), Э3А3 (12 pins)